# Altium schematic sheet USBCOMPORT-TTL.SchDoc
size A4; SheetNumber: 1; SheetTotal: 4
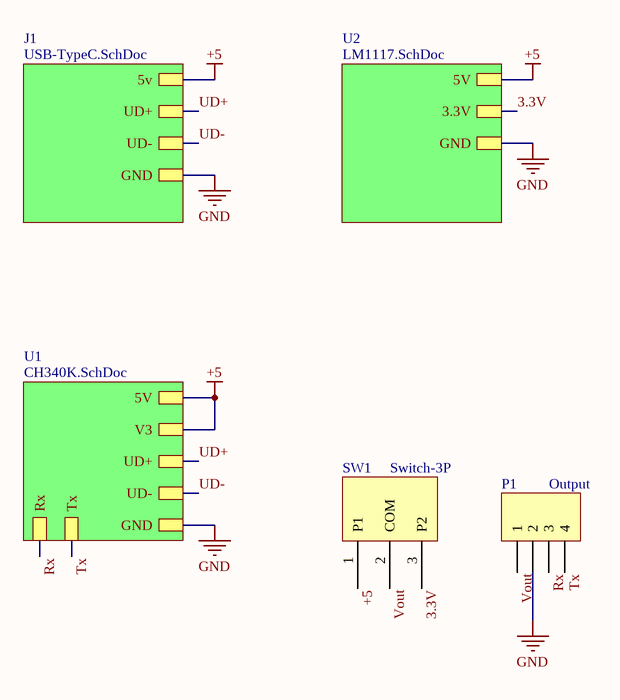
[diagram p0: USBCOMPORT-TTL.SchDoc]

## Parts
P1  Output  [HDR1X4]
SW1  Switch-3P  [SS-12D00(1P2T)]

## Sub-sheets
J1 = USB-TypeC.SchDoc: 5v, GND, UD+, UD-
U1 = CH340K.SchDoc: 5V, V3, UD+, UD-, GND, Rx, Tx
U2 = LM1117.SchDoc: 5V, 3.3V, GND

## Nets
+5: SW1.1(P1) ; sheet J1/5v, sheet U1/5V, sheet U1/V3, sheet U2/5V
GND: P1.2 ; sheet J1/GND, sheet U1/GND, sheet U2/GND
3.3V: SW1.3(P2) ; sheet U2/3.3V
Rx: P1.3 ; sheet U1/Rx
Tx: P1.4 ; sheet U1/Tx
UD+: sheet J1/UD+, sheet U1/UD+
UD-: sheet J1/UD-, sheet U1/UD-
Vout: P1.1 SW1.2(COM)

## Library data of the parts
P1 = Header 4: Header, 4-Pin; LatestRevisionDate: 17-Jul-2002; LatestRevisionNote: Re-released for DXP Platform.; Publisher: Altium Limited